# Altium schematic sheet ATSAMB11.SchDoc
size A4
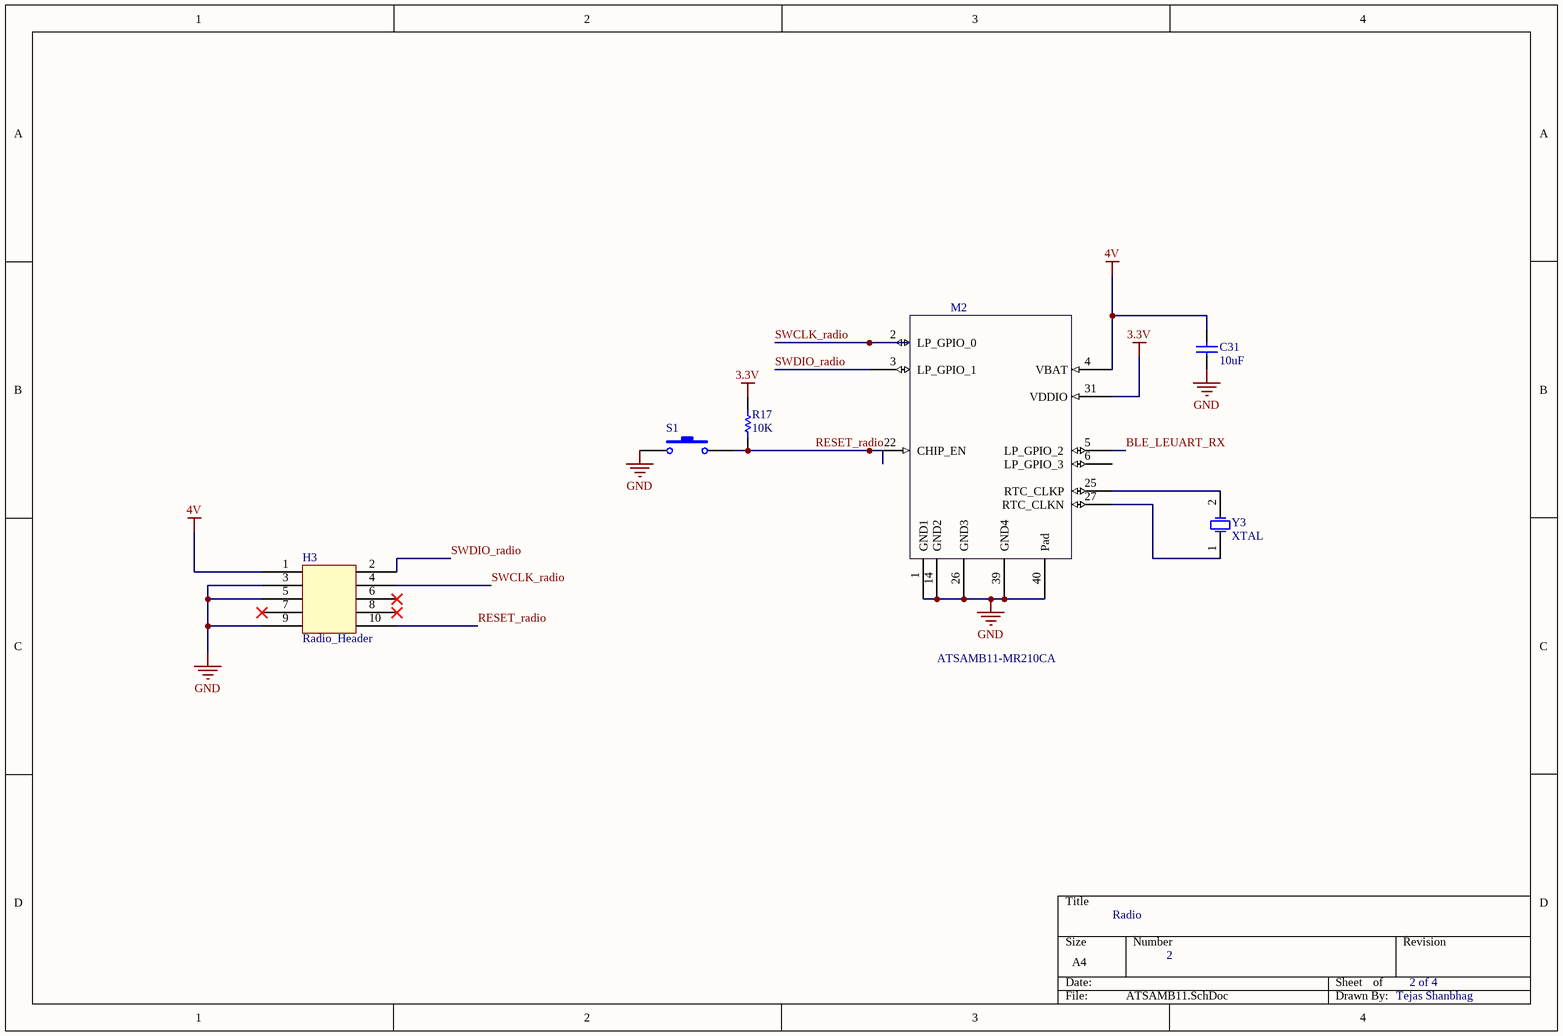
[diagram p0: ATSAMB11.SchDoc]

## Parts
C31  value 10uF  [1608[0603]]  (hidden comment: Cap Semi)
H3  Radio_Header  [Cortex Debug Header]
M2  ATSAMB11-MR210CA  [ATMELSAMB11]
R17  value 10K  [1608[0603]]  (hidden comment: Res1)
S1  SW-PB  [RESET]  (value not drawn)
Y3  XTAL  [Clock_LFXTAL]

## Nets
3.3V: M2.31(VDDIO) R17.2
4V: C31.2 H3.1 M2.4(VBAT)
GND: C31.1 H3.3 H3.5 H3.9 M2.1(GND1) M2.14(GND2) M2.26(GND3) M2.39(GND4) M2.40(Pad) S1.1
BLE_LEUART_RX: M2.5(LP_GPIO_2)
RESET_radio: H3.10 M2.22(CHIP_EN) R17.1 S1.2
SWCLK_radio: H3.4 M2.2(LP_GPIO_0)
SWDIO_radio: H3.2 M2.3(LP_GPIO_1)
NetM2_25: M2.25(RTC_CLKP) Y3.2(OSC2)
NetM2_27: M2.27(RTC_CLKN) Y3.1(OSC1)

Not connected (* = marked no-connect by the designer): H3 6* 7* 8*; M2 6(LP_GPIO_3)

## Notes on the sheet
- Radio
- 2
- 2 of 4
- Tejas Shanbhag

## Library data of the parts
C31 = Cap Semi: CAP CER 10UF 10V X5R 0603; Manufacturer: Murata Electronics North America; Manufacturer Part Number: GRM188R61A106KE69D; ComponentLink1Description: Datasheet; ComponentLink1URL: http://search.murata.co.jp/Ceramy/image/img/A01X/partnumbering_e_01.pdf; Digikey Part No: 490-10474-1-ND
H3 = Radio_Header: CONN HDR 1.27MM SMD AU 10POS; Manufacturer: Harwin Inc.; Manufacturer Part Number: M50-3600542; ComponentLink1Description: Datasheet; ComponentLink1URL: https://cdn.harwin.com/pdfs/M50-360.pdf; Digikey Part No: 952-1389-ND
M2 = ATSAMB11: Bluetooth / 802.15.1 Modules Chip Antenna UFL connector MU-T; Manufacturer: Microchip Technology/Atmel; Manufacturer Part Number: ATSAMB11-MR210CA; Mouser Part No: 556-ATSAMB11-MR210CA; ComponentLink1URL: http://www.mouser.com/ProductDetail/Atmel/ATSAMB11-MR210CA/?qs=ma0NyvTRVt1T4DTX%252bAca0w==; ComponentLink1Description: link
R17 = Res1: RES SMD 10K OHM 1% 1/10W 0603; Manufacturer: Yageo; Manufacturer Part Number: RC0603FR-0710KL; ComponentLink1Description: Datasheet; ComponentLink1URL: http://www.yageo.com.tw/exep/pages/download/literatures/PYu-R_INT-thick_7.pdf; Digikey Part No: 311-10.0KHRCT-ND
S1 = SW-PB: SWITCH TACTILE SPST-NO 0.05A 15V; Manufacturer Part Number: TL3315NF160Q; Manufacturer: E-Switch; ComponentLink1Description: Datasheet; ComponentLink1URL: https://media.digikey.com/pdf/Data%20Sheets/E-Switch%20PDFs/TL3315.pdf; Digikey Part No: EG4621CT-ND
Y3 = XTAL: CRYSTAL 32.7680KHZ 12.5PF SMD; Manufacturer Part Number: AB26TRQ-32.768KHZ-T; Manufacturer: Abracon LLC; Value: 32.768kHz; ComponentLink1URL: https://www.digikey.com/products/en/crystals-oscillators-resonators/crystals/171?k=+AB26TRQ&k=&pkeyword=+AB26TRQ&pv7=2&mnonly=0&newproducts=0&ColumnSort=0&page=1&quantity=0&ptm=0&fid=0&pageSize=25; Digikey Part No: 535-12051-1-ND; ComponentLink1Description: link